# Altium schematic sheet Potencia_Moway.SchDoc: Potencia Moway
size A3; Date: <Fecha>; CheckedBy: <>; DrawnBy: <>; Organization: Bizintek Innova S.L.; Revision: V2; SheetNumber: 3; SheetTotal: 3; PageSetup: Record=PageOptions|CenterHorizontal=True|CenterVertical=True|PrintScale=1.00|XCorrection=1.00|YCorrection=1.00|PrintKind=0|BorderSize=5000000|LeftOffset=0|BottomOffset=0|Orientation=2|PaperLength=1000|PaperWidth=1000|Scale=100|PaperSource=7|PrintQuality=-3|MediaType=1|DitherType=10|PrintScaleMode=0|PaperKind=A4|PaperIndex=9; ProjectName: <Nombre Proyecto>
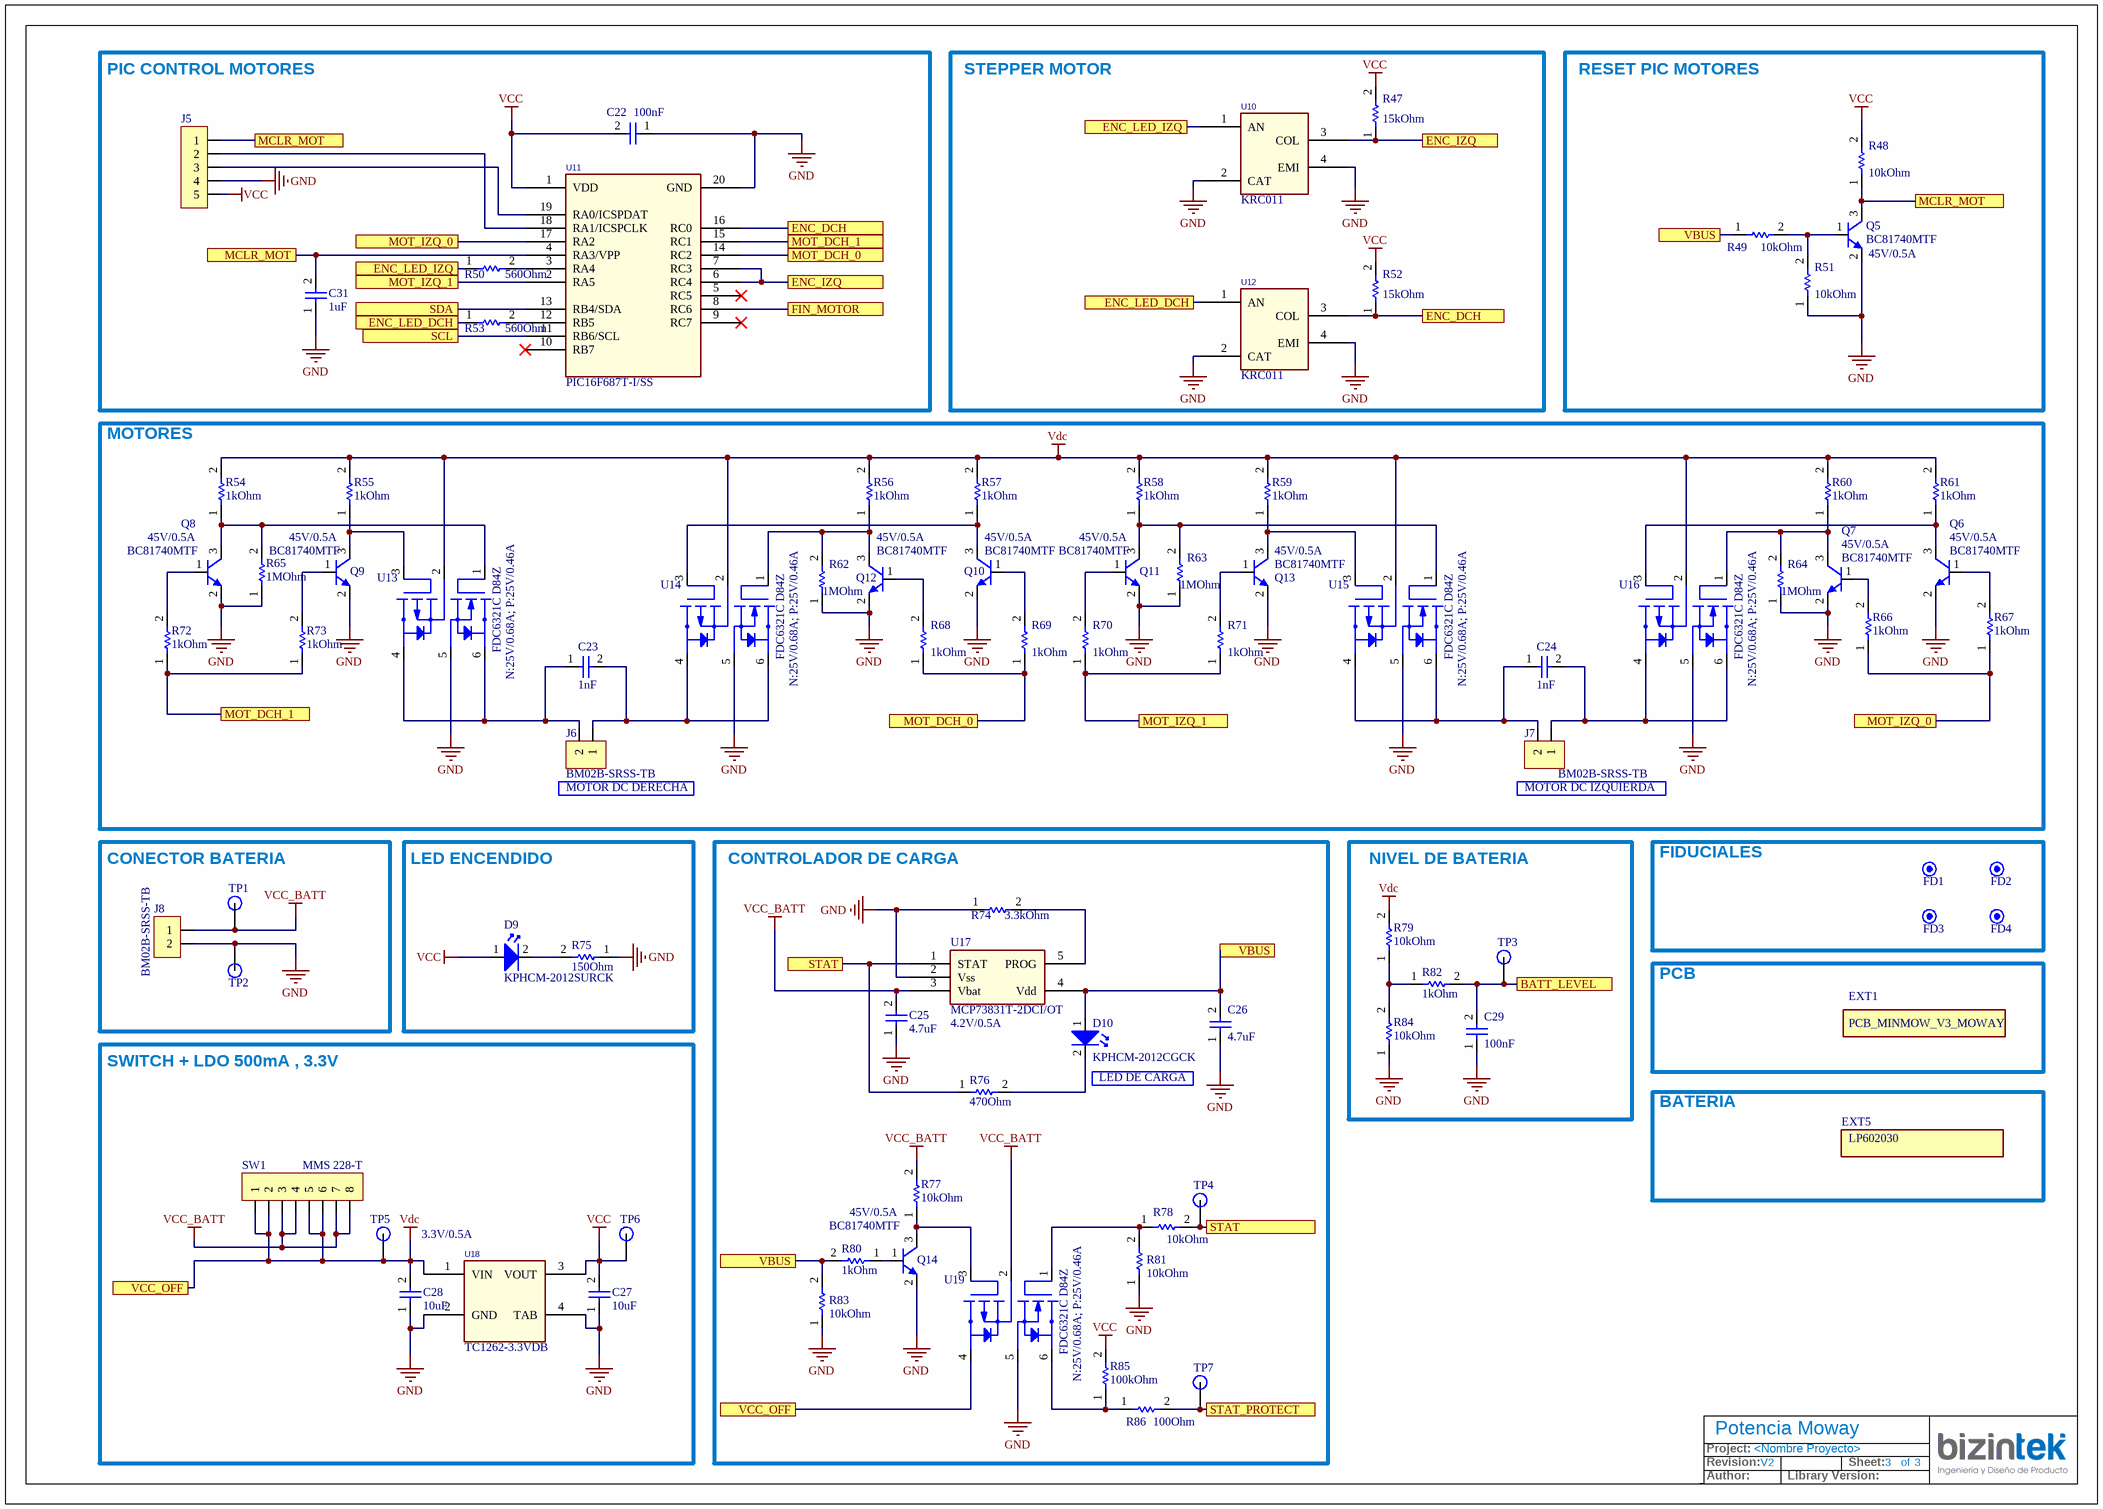
[diagram p0: Potencia_Moway.SchDoc]

## Parts
C22  value 100nF  [C0402]  (hidden comment: C100NV10X7R0402)
C23  value 1nF  [C0402]  (hidden comment: C1NV10X7R0402)
C24  value 1nF  [C0402]  (hidden comment: C1NV10X7R0402)
C25  value 4.7uF  [C0402]  (hidden comment: C4U7V10X5R0402)
C26  value 4.7uF  [C0402]  (hidden comment: C4U7V10X5R0402)
C27  value 10uF  [C0603]  (hidden comment: C10UV10X5R0603)
C28  value 10uF  [C0603]  (hidden comment: C10UV10X5R0603)
C29  value 100nF  [C0402]  (hidden comment: C100NV10X7R0402)
C31  value 1uF  [C0402]  (hidden comment: C1UV10X5R0402)
D9  Manufacturer Part Number: KPHCM-2012SURCK  [LED0805]  (hidden comment: KPHCM2012SURCK)
D10  Manufacturer Part Number: KPHCM-2012CGCK  [LED0805]  (hidden comment: KPHCM2012CGCK)
EXT1  PCB_MINMOW_V3_MOWAY  (mechanical)
EXT5  LP602030  value 3.7V/0.30Ah  (mechanical)
FD1  FIDUCIAL  [FIDUCIAL]  (value not drawn)  (no BOM)
FD2  FIDUCIAL  [FIDUCIAL]  (value not drawn)  (no BOM)
FD3  FIDUCIAL  [FIDUCIAL]  (value not drawn)  (no BOM)
FD4  FIDUCIAL  [FIDUCIAL]  (value not drawn)  (no BOM)
J5  PAD_5PIN_TH_2X1MM_1.5MM_PITCH  [PAD_5PIN_TH_2X1MM_1.5MM_PITCH]  (value not drawn)  (no BOM)
J6  Manufacturer Part Number: BM02B-SRSS-TB  [BM02BSRSSTB_JST]  (hidden comment: BM02BSRSSTB)
J7  Manufacturer Part Number: BM02B-SRSS-TB  [BM02BSRSSTB_JST]  (hidden comment: BM02BSRSSTB)
J8  Manufacturer Part Number: BM02B-SRSS-TB  [BM02BSRSSTB_JST]  (hidden comment: BM02BSRSSTB)
Q5  value 45V/0.5A  [SOT23_FAIRCHILD]  (hidden comment: BC81740MTF)
Q6  value 45V/0.5A  [SOT23_FAIRCHILD]  (hidden comment: BC81740MTF)
Q7  value 45V/0.5A  [SOT23_FAIRCHILD]  (hidden comment: BC81740MTF)
Q8  value 45V/0.5A  [SOT23_FAIRCHILD]  (hidden comment: BC81740MTF)
Q9  value 45V/0.5A  [SOT23_FAIRCHILD]  (hidden comment: BC81740MTF)
Q10  value 45V/0.5A  [SOT23_FAIRCHILD]  (hidden comment: BC81740MTF)
Q11  value 45V/0.5A  [SOT23_FAIRCHILD]  (hidden comment: BC81740MTF)
Q12  value 45V/0.5A  [SOT23_FAIRCHILD]  (hidden comment: BC81740MTF)
Q13  value 45V/0.5A  [SOT23_FAIRCHILD]  (hidden comment: BC81740MTF)
Q14  value 45V/0.5A  [SOT23_FAIRCHILD]  (hidden comment: BC81740MTF)
R47  value 15kOhm  [R0402]  (hidden comment: R15KT10402)
R48  value 10kOhm  [R0402]  (hidden comment: R10KT10402)
R49  value 10kOhm  [R0402]  (hidden comment: R10KT10402)
R50  value 560Ohm  [R0402]  (hidden comment: R560T10402)
R51  value 10kOhm  [R0402]  (hidden comment: R10KT10402)
R52  value 15kOhm  [R0402]  (hidden comment: R15KT10402)
R53  value 560Ohm  [R0402]  (hidden comment: R560T10402)
R54  value 1kOhm  [R0402]  (hidden comment: R1KT10402)
R55  value 1kOhm  [R0402]  (hidden comment: R1KT10402)
R56  value 1kOhm  [R0402]  (hidden comment: R1KT10402)
R57  value 1kOhm  [R0402]  (hidden comment: R1KT10402)
R58  value 1kOhm  [R0402]  (hidden comment: R1KT10402)
R59  value 1kOhm  [R0402]  (hidden comment: R1KT10402)
R60  value 1kOhm  [R0402]  (hidden comment: R1KT10402)
R61  value 1kOhm  [R0402]  (hidden comment: R1KT10402)
R62  value 1MOhm  [R0402]  (hidden comment: R1MT10402)
R63  value 1MOhm  [R0402]  (hidden comment: R1MT10402)
R64  value 1MOhm  [R0402]  (hidden comment: R1MT10402)
R65  value 1MOhm  [R0402]  (hidden comment: R1MT10402)
R66  value 1kOhm  [R0402]  (hidden comment: R1KT10402)
R67  value 1kOhm  [R0402]  (hidden comment: R1KT10402)
R68  value 1kOhm  [R0402]  (hidden comment: R1KT10402)
R69  value 1kOhm  [R0402]  (hidden comment: R1KT10402)
R70  value 1kOhm  [R0402]  (hidden comment: R1KT10402)
R71  value 1kOhm  [R0402]  (hidden comment: R1KT10402)
R72  value 1kOhm  [R0402]  (hidden comment: R1KT10402)
R73  value 1kOhm  [R0402]  (hidden comment: R1KT10402)
R74  value 3.3kOhm  [R0402]  (hidden comment: R3K3T10402)
R75  value 150Ohm  [R0402]  (hidden comment: R150T10402)
R76  value 470Ohm  [R0402]  (hidden comment: R470T10402)
R77  value 10kOhm  [R0402]  (hidden comment: R10KT10402)
R78  value 10kOhm  [R0402]  (hidden comment: R10KT10402)
R79  value 10kOhm  [R0402]  (hidden comment: R10KT10402)
R80  value 1kOhm  [R0402]  (hidden comment: R1KT10402)
R81  value 10kOhm  [R0402]  (hidden comment: R10KT10402)
R82  value 1kOhm  [R0402]  (hidden comment: R1KT10402)
R83  value 10kOhm  [R0402]  (hidden comment: R10KT10402)
R84  value 10kOhm  [R0402]  (hidden comment: R10KT10402)
R85  value 100kOhm  [R0402]  (hidden comment: R100KT10402)
R86  value 100Ohm  [R0402]  (hidden comment: R100T10402)
SW1  Manufacturer Part Number: MMS 228-T  [MMS228T]  (hidden comment: MMS228T)
TP1  TEST_POINT_1MM  [TEST_POINT_1MM]  (value not drawn)  (no BOM)
TP2  TEST_POINT_1MM  [TEST_POINT_1MM]  (value not drawn)  (no BOM)
TP3  TEST_POINT_1MM  [TEST_POINT_1MM]  (value not drawn)  (no BOM)
TP4  TEST_POINT_1MM  [TEST_POINT_1MM]  (value not drawn)  (no BOM)
TP5  TEST_POINT_1MM  [TEST_POINT_1MM]  (value not drawn)  (no BOM)
TP6  TEST_POINT_1MM  [TEST_POINT_1MM]  (value not drawn)  (no BOM)
TP7  TEST_POINT_1MM  [TEST_POINT_1MM]  (value not drawn)  (no BOM)
U10  KRC011  [KRC011]
U11  Manufacturer Part Number: PIC16F687T-I/SS  [SSOP20_MCP]  (hidden comment: PIC16F687TISS)
U12  KRC011  [KRC011]
U13  value N:25V/0.68A; P:25V/0.46A  Manufacturer Part Number: FDC6321C D84Z  [SUPERSOT6_ONSEMI]  (hidden comment: FDC6321CD84Z)
U14  value N:25V/0.68A; P:25V/0.46A  Manufacturer Part Number: FDC6321C D84Z  [SUPERSOT6_ONSEMI]  (hidden comment: FDC6321CD84Z)
U15  value N:25V/0.68A; P:25V/0.46A  Manufacturer Part Number: FDC6321C D84Z  [SUPERSOT6_ONSEMI]  (hidden comment: FDC6321CD84Z)
U16  value N:25V/0.68A; P:25V/0.46A  Manufacturer Part Number: FDC6321C D84Z  [SUPERSOT6_ONSEMI]  (hidden comment: FDC6321CD84Z)
U17  value 4.2V/0.5A  Manufacturer Part Number: MCP73831T-2DCI/OT  [SOT23-5_MCP]  (hidden comment: MCP73831T2DCIOT)
U18  value 3.3V/0.5A  Manufacturer Part Number: TC1262-3.3VDB  [SOT223_MCP]  (hidden comment: TC126233VDB)
U19  value N:25V/0.68A; P:25V/0.46A  Manufacturer Part Number: FDC6321C D84Z  [SUPERSOT6_ONSEMI]  (hidden comment: FDC6321CD84Z)

## Blocks framed on the sheet
PIC CONTROL MOTORES: C22 C31 J5 R50 R53 U11
STEPPER MOTOR: R47 R52 U10 U12
RESET PIC MOTORES: Q5 R48 R49 R51
MOTORES: C23 C24 J6 J7 Q6-Q13 R54-R73 U13-U16
CONECTOR BATERIA: J8 TP1 TP2
LED ENCENDIDO: D9 R75
CONTROLADOR DE CARGA: C25 C26 D10 Q14 R74 R76-R78 R80 R81 R83 R85 R86 TP4 TP7 U17 U19
NIVEL DE BATERIA: C29 R79 R82 R84 TP3
FIDUCIALES: FD1-FD4
PCB: EXT1
SWITCH + LDO 500mA , 3.3V: C27 C28 SW1 TP5 TP6 U18
BATERIA: EXT5

## Ports
BATT_LEVEL, ENC_DCH, ENC_IZQ, ENC_LED_DCH, ENC_LED_IZQ, FIN_MOTOR, MCLR_MOT, MOT_DCH_0, MOT_DCH_1, MOT_IZQ_0, MOT_IZQ_1, SCL, SDA, STAT, STAT_PROTECT, VBUS, VCC_OFF

## Nets
GND: C22.1 C25.1 C26.1 C27.1 C28.1 C29.1 C31.1 J5.4 J8.2 Q5.2(E) Q6.2(E) Q7.2(E) Q8.2(E) Q9.2(E) Q10.2(E) Q11.2(E) Q12.2(E) Q13.2(E) Q14.2(E) R51.1 R62.1 R63.1 R64.1 R65.1 R74.1 R75.1 R81.1 R83.1 R84.1 TP2.1 U10.2(CAT) U10.4(EMI) U11.20(GND) U12.2(CAT) U12.4(EMI) U13.5(S2) U14.5(S2) U15.5(S2) U16.5(S2) U17.2(Vss) U18.2(GND) U18.4(TAB) U19.5(S2)
VCC: C22.2 C27.2 D9.1(A) J5.5 R47.2 R48.2 R52.2 R85.2 TP6.1 U11.1(VDD) U18.3(VOUT)
VCC_BATT: C25.2 J8.1 R77.2 SW1.3 SW1.4 SW1.7 SW1.8 TP1.1 U17.3(Vbat) U19.2(S1)
Vdc: C28.2 R54.2 R55.2 R56.2 R57.2 R58.2 R59.2 R60.2 R61.2 R79.2 SW1.1 SW1.2 SW1.5 SW1.6 TP5.1 U13.2(S1) U14.2(S1) U15.2(S1) U16.2(S1) U18.1(VIN) U19.4(D1) ; port VCC_OFF
BATT_LEVEL: C29.2 R82.2 TP3.1 ; port BATT_LEVEL
ENC_DCH: R52.1 U11.16(RC0) U12.3(COL) ; port ENC_DCH
ENC_IZQ: R47.1 U10.3(COL) U11.6(RC4) U11.7(RC3) ; port ENC_IZQ
ENC_LED_DCH: R53.1 U12.1(AN) ; port ENC_LED_DCH
ENC_LED_IZQ: R50.1 U10.1(AN) ; port ENC_LED_IZQ
FIN_MOTOR: U11.8(RC6) ; port FIN_MOTOR
MCLR_MOT: C31.2 J5.1 Q5.3(C) R48.1 U11.4(RA3/VPP) ; port MCLR_MOT
MOT_DCH_0: R68.1 R69.1 U11.14(RC2) ; port MOT_DCH_0
MOT_DCH_1: R72.1 R73.1 U11.15(RC1) ; port MOT_DCH_1
MOT_IZQ_0: R66.1 R67.1 U11.17(RA2) ; port MOT_IZQ_0
MOT_IZQ_1: R70.1 R71.1 U11.2(RA5) ; port MOT_IZQ_1
SCL: U11.11(RB6/SCL) ; port SCL
SDA: U11.13(RB4/SDA) ; port SDA
STAT: R76.1 R78.2 TP4.1 U17.1(STAT) ; port STAT
STAT_PROTECT: R86.2 TP7.1 ; port STAT_PROTECT
VBUS: C26.2 D10.1(A) R49.1 R80.2 R83.2 U17.4(Vdd) ; port VBUS
NetC23_1: C23.1 J6.2 U13.4(D1) U13.6(D2)
NetC23_2: C23.2 J6.1 U14.4(D1) U14.6(D2)
NetC24_1: C24.1 J7.2 U15.4(D1) U15.6(D2)
NetC24_2: C24.2 J7.1 U16.4(D1) U16.6(D2)
NetD9_2: D9.2(K) R75.2
NetD10_2: D10.2(K) R76.2
NetJ5_2: J5.2 U11.18(RA1/ICSPCLK)
NetJ5_3: J5.3 U11.19(RA0/ICSPDAT)
NetQ5_1: Q5.1(B) R49.2 R51.2
NetQ6_1: Q6.1(B) R67.2
NetQ6_3: Q6.3(C) R61.1 U16.3(G1)
NetQ7_1: Q7.1(B) R66.2
NetQ7_3: Q7.3(C) R60.1 R64.2 U16.1(G2)
NetQ8_1: Q8.1(B) R72.2
NetQ8_3: Q8.3(C) R54.1 R65.2 U13.1(G2)
NetQ9_1: Q9.1(B) R73.2
NetQ9_3: Q9.3(C) R55.1 U13.3(G1)
NetQ10_1: Q10.1(B) R69.2
NetQ10_3: Q10.3(C) R57.1 U14.3(G1)
NetQ11_1: Q11.1(B) R70.2
NetQ11_3: Q11.3(C) R58.1 R63.2 U15.1(G2)
NetQ12_1: Q12.1(B) R68.2
NetQ12_3: Q12.3(C) R56.1 R62.2 U14.1(G2)
NetQ13_1: Q13.1(B) R71.2
NetQ13_3: Q13.3(C) R59.1 U15.3(G1)
NetQ14_1: Q14.1(B) R80.1
NetQ14_3: Q14.3(C) R77.1 U19.3(G1)
NetR50_2: R50.2 U11.3(RA4)
NetR53_2: R53.2 U11.12(RB5)
NetR74_2: R74.2 U17.5(PROG)
NetR78_1: R78.1 R81.2 U19.1(G2)
NetR79_1: R79.1 R82.1 R84.2
NetR85_1: R85.1 R86.1 U19.6(D2)

Not connected (* = marked no-connect by the designer): U11 5(RC5)* 9(RC7)* 10(RB7)*

## Notes on the sheet
- (near J6) MOTOR DC DERECHA
- (near J7) MOTOR DC IZQUIERDA
- (near D10) LED DE CARGA
- Project:
- Revision:
- Author:
- Library Version:
- Sheet:
- of

## Library data of the parts
C22 C29 = C100NV10X7R0402: CAPACITOR SMD 0402, 100nF, 10V, X7R; Voltage: 10; Type: Passive/Capacitor; Part Number: C100NV10X7R0402; Dielectric: X7R
C23 C24 = C1NV10X7R0402: CAPACITOR SMD 0402, 1nF, 10V, X7R; Type: Passive/Capacitor; Part Number: C1NV10X7R0402; Dielectric: X7R
C25 C26 = C4U7V10X5R0402: CAPACITOR SMD 0402, 4.7uF, 10V, X5R; Voltage: 10; Type: Passive/Capacitor; Part Number: C4U7V10X5R0402; Dielectric: X5R
C27 C28 = C10UV10X5R0603: CAPACITOR SMD 0603, 10uF, 10V, X5R; Voltage: 10; Type: Passive/Capacitor; Part Number: C10UV10X5R0603; Dielectric: X5R
C31 = C1UV10X5R0402: CAPACITOR SMD 0402, 1uF, 10V, X5R; Type: Passive/Capacitor; Part Number: C1UV10X5R0402; Dielectric: X5R
D9 = KPHCM2012SURCK: LED, Low Power, Red, SMD, 20 mA, 1.95 V, 630 nm; Manufacturer: KINGBRIGHT; Part Number: KPHCM2012SURCK; Supplier 1: Farnell; Supplier Part Number 1: 1686067; Supplier 2: RS; Supplier Part Number 2: 861-0119; Type: LED; Datasheet MPN 1: http://datasheet.octopart.com/KPHCM-2012SURCK-Kingbright-datasheet-15687796.pdf
D10 = KPHCM2012CGCK: LED, Low Power, Green, SMD, 20 mA, 2.1 V, 570 nm; Manufacturer: KINGBRIGHT; Part Number: KPHCM2012CGCK; Supplier 1: Farnell; Supplier Part Number 1: 1686075; Supplier 2: RS; Supplier Part Number 2: 861-0107; Type: LED; Datasheet MPN 1: http://datasheet.octopart.com/KPHCM-2012CGCK-Kingbright-datasheet-14708382.pdf
EXT1 = PCB: Part Number: PCB; Manufacturer: BIZINTEK; Type: Miscellaneous
EXT5 = LP602030: Li-Polymer Battery, 3.7V, 300mAh; Manufacturer: EEMB; Part Number: LP602030; Manufacturer Part Number: LP602030; Type: Battery
J6-J8 = BM02BSRSSTB: Wire-To-Board Connector, Top Entry, 1 mm, 2 Contacts, Header, SR Series, Surface Mount, 1 Rows; Manufacturer: JST; Part Number: BM02BSRSSTB; Supplier 1: Digikey; Supplier Part Number 1: 455-1788-1-ND; Supplier 2: Farnell; Supplier Part Number 2: 1679127; Type: Connector; Datasheet MPN 1: http://datasheet.octopart.com/BM02B-SRSS-TB%28LF%29%28SN%29-JST-datasheet-5322443.pdf
Q5-Q14 = BC81740MTF: Bipolar (BJT) Single Transistor, NPN, 45 V, 170 MHz, 300 mW, 500 mA, 250 hFE; Manufacturer: FAIRCHILD; Type: Transistor/BJT; Current: 0.5; Part Number: BC81740MTF; Manufacturer Part Number: BC81740MTF; Supplier 1: Farnell; Supplier Part Number 1: 1798081; Supplier 2: Mouser; Supplier Part Number 2: 512-BC81740MTF; Datasheet MPN 1: http://datasheet.octopart.com/BC81740MTF-Fairchild-datasheet-56423.pdf
R47 R52 = R15KT10402: RESISTOR SMD 0402, 15kOhm, 1%; Tolerance: 1; Part Number: R15KT10402; Type: Passive/Resistor
R48 R49 R51 R77-R79 R81 R83 R84 = R10KT10402: RESISTOR SMD 0402, 10kOhm, 1%; Tolerance: 1; Part Number: R10KT10402; Type: Passive/Resistor; Datasheet MPN 2: http://datasheet.octopart.com/CRCW040210K0FKED.-Vishay-datasheet-78776209.pdf; Manufacturer 2: VISHAY; Manufacturer Part Number 2: CRCW040210K0FKED; Supplier 1 -MPN 2: Digikey; Supplier 2 - MPN 2: Mouser; Supplier Part Number 1 - MPN 2: 541-10.0KLDKR-ND; Supplier Part Number 2 - MPN 2: CRCW040210K0FKED
R50 R53 = R560T10402: RESISTOR SMD 0402, 560Ohm, 1%; Tolerance: 1; Part Number: R560T10402; Type: Passive/Resistor
R54-R61 R66-R73 R80 R82 = R1KT10402: RESISTOR SMD 0402, 1kOhm, 1%; Tolerance: 1; Part Number: R1KT10402; Type: Passive/Resistor
R62-R65 = R1MT10402: RESISTOR SMD 0402, 1MOhm, 1%; Tolerance: 1; Part Number: R1MT10402; Type: Passive/Resistor
R74 = R3K3T10402: RESISTOR SMD 0402, 3.3kOhm, 1%; Tolerance: 1; Part Number: R3K3T10402; Type: Passive/Resistor
R75 = R150T10402: RESISTOR SMD 0402, 150Ohm, 1%; Tolerance: 1; Part Number: R150T10402; Type: Passive/Resistor
R76 = R470T10402: RESISTOR SMD 0402, 470Ohm, 1%; Tolerance: 1; Part Number: R470T10402; Type: Passive/Resistor
R85 = R100KT10402: RESISTOR SMD 0402, 100kOhm, 1%; Tolerance: 1; Part Number: R100KT10402; Type: Passive/Resistor; Datasheet MPN 2: http://datasheet.octopart.com/CRCW0402100KFKED.-Vishay-datasheet-78776209.pdf; Manufacturer 2: VISHAY; Manufacturer Part Number 2: CRCW0402100KFKED; Supplier 1 -MPN 2: Digikey; Supplier 2 - MPN 2: Mouser; Supplier Part Number 1 - MPN 2: 541-100KLCT-ND; Supplier Part Number 2 - MPN 2: CRCW0402100KFKED
R86 = R100T10402: RESISTOR SMD 0402, 100Ohm, 1%; Tolerance: 1; Part Number: R100T10402; Type: Passive/Resistor
SW1 = MMS228T: Slide Switch, DPDT, On-On, SMD, 300 mA; Manufacturer: KNITTER; Part Number: MMS228T; Supplier 1: Farnell; Supplier Part Number 1: 8546819; Supplier 2: RS; Supplier Part Number 2: 711-8329; Type: Switch; Datasheet MPN 1: http://datasheet.octopart.com/MMS-228-T-Knitter-Switch-datasheet-20803805.pdf
U10 U12 = KRC011: High Sensitivity Photointerrupter; Manufacturer: KINGBRIGHT; Part Number: KRC011; Manufacturer Part Number: KRC011; Supplier 1: RS; Supplier Part Number 1: 616-5709; Type: Optoacoplador; Datasheet MPN 1: http://docs-europe.electrocomponents.com/webdocs/07a5/0900766b807a59d4.pdf
U11 = PIC16F687TISS: 20 PIN FLASH 8-Bit CMOS MCU; Manufacturer: MICROCHIP; Part Number: PIC16F687TISS; Supplier 1: Digikey; Supplier Part Number 1: PIC16F687T-I/SSCT-ND; Supplier 2: Mouser; Supplier Part Number 2: 579-PIC16F687T-I/SS; Type: MCU; Datasheet MPN 1: http://datasheet.octopart.com/PIC16F687T-I/SS-Microchip-datasheet-7621703.pdf
U13-U16 U19 = FDC6321CD84Z: Dual MOSFET, N and P Channel, 460 mA, 25 V, 0.33 ohm, 4.5 V, 800 mV; Manufacturer: FAIRCHILD; Current: N:0.68;P:0.46; Part Number: FDC6321CD84Z; Supplier 1: Farnell; Supplier Part Number 1: 9844848; Supplier 2: Mouser; Supplier Part Number 2: 512-FDC6321C; Type: Transistor/MOSFET; Datasheet MPN 1: http://www.onsemi.com/pub/Collateral/FDC6321C-D.PDF
U17 = MCP73831T2DCIOT: Battery Charger for 1 Cell of Li-Ion, Li-Pol battery, 6V input, 4.2V / 500mA charge; Manufacturer: MICROCHIP; Current: 0.5; Part Number: MCP73831T2DCIOT; Supplier 1: Digikey; Supplier Part Number 1: MCP73831T-2DCI/OTCT-ND; Supplier 2: Mouser; Supplier Part Number 2: 579-MCP73831T-2DCIOT; Type: Battery Charger/Controller; Datasheet MPN 1: http://datasheet.octopart.com/MCP73831T-2DCI/OT-Microchip-datasheet-8814540.pdf
U18 = TC126233VDB: 500mA Fixed Output CMOS LDO. 6V Vin, 3.3 Vout, 0.5Aout; Manufacturer: MICROCHIP; Current: 0.5; Part Number: TC126233VDB; Supplier 1: Digikey; Supplier Part Number 1: TC1262-3.3VDB-ND; Supplier 2: Mouser; Supplier Part Number 2: 579-TC1262-3.3VDB; Type: LDO; Datasheet MPN 1: http://datasheet.octopart.com/TC1262-3.3VDB-Microchip-datasheet-22095.pdf
FD1-FD4 = FIDUCIAL: Part Number: FIDUCIAL; Type: Miscellaneous
J5 = PAD_5PIN_TH_2X1MM_1.5MM_PITCH: Part Number: PAD_5PIN_TH_2X1MM_1.5MM_PITCH; Type: Miscellaneous
TP1-TP7 = TEST_POINT_1MM: Part Number: TEST_POINT_1MM; Type: Miscellaneous